# EAGLE schematic AZR3350 (EAGLE 9.3.0)
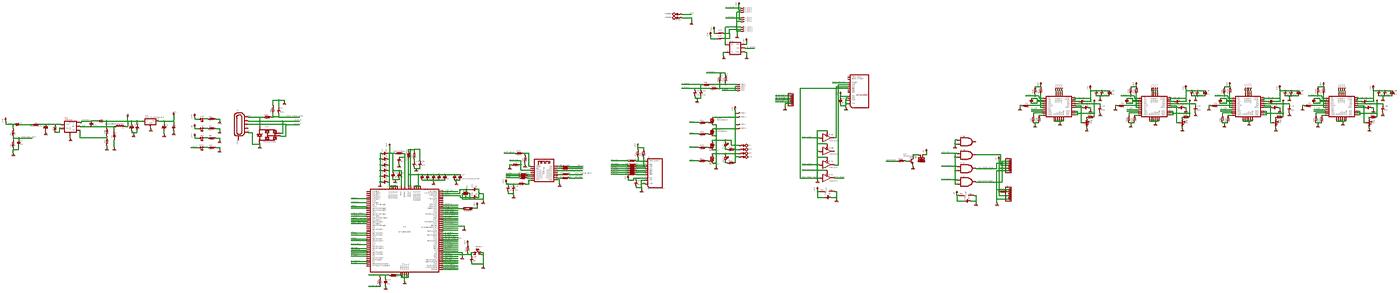
[diagram p0: schematic, sheet 1, overview]
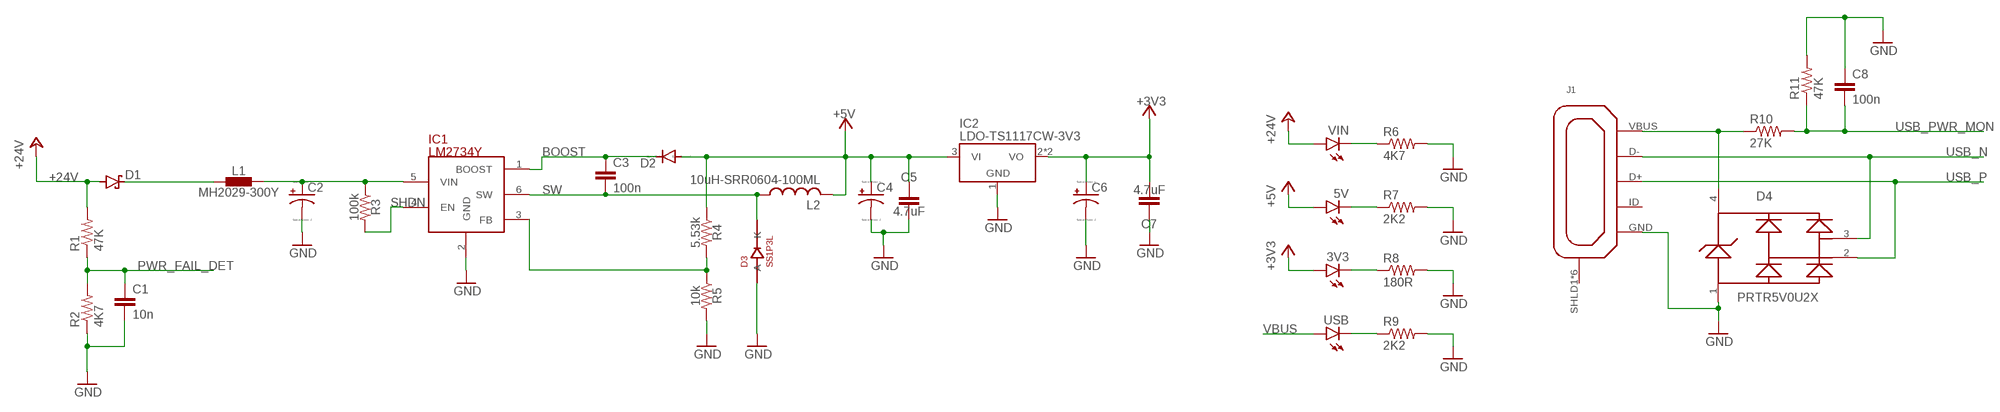
[diagram p1: schematic, sheet 1, part 1 of 5]
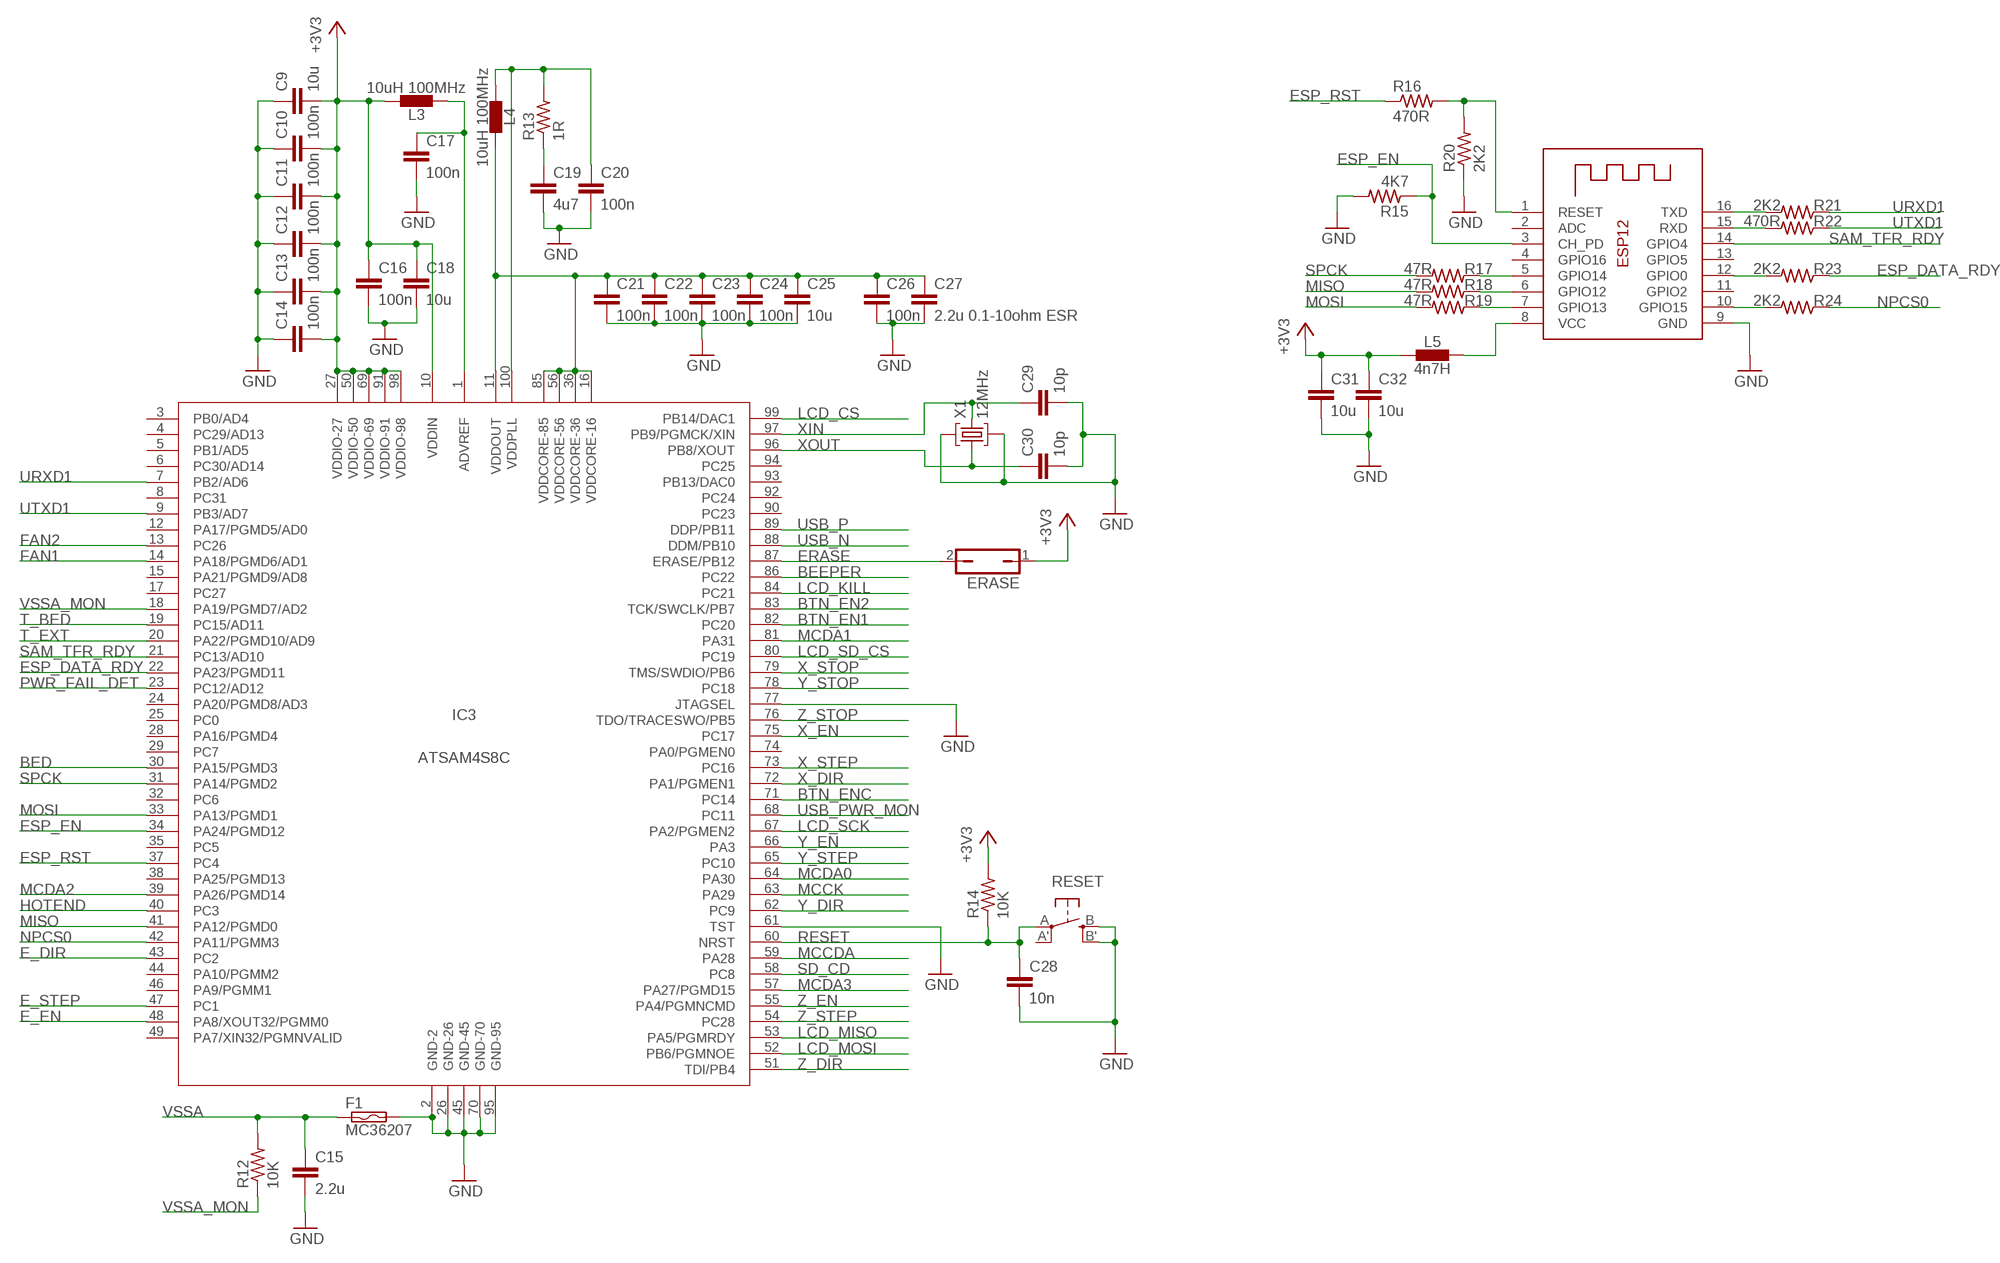
[diagram p2: schematic, sheet 1, part 2 of 5]
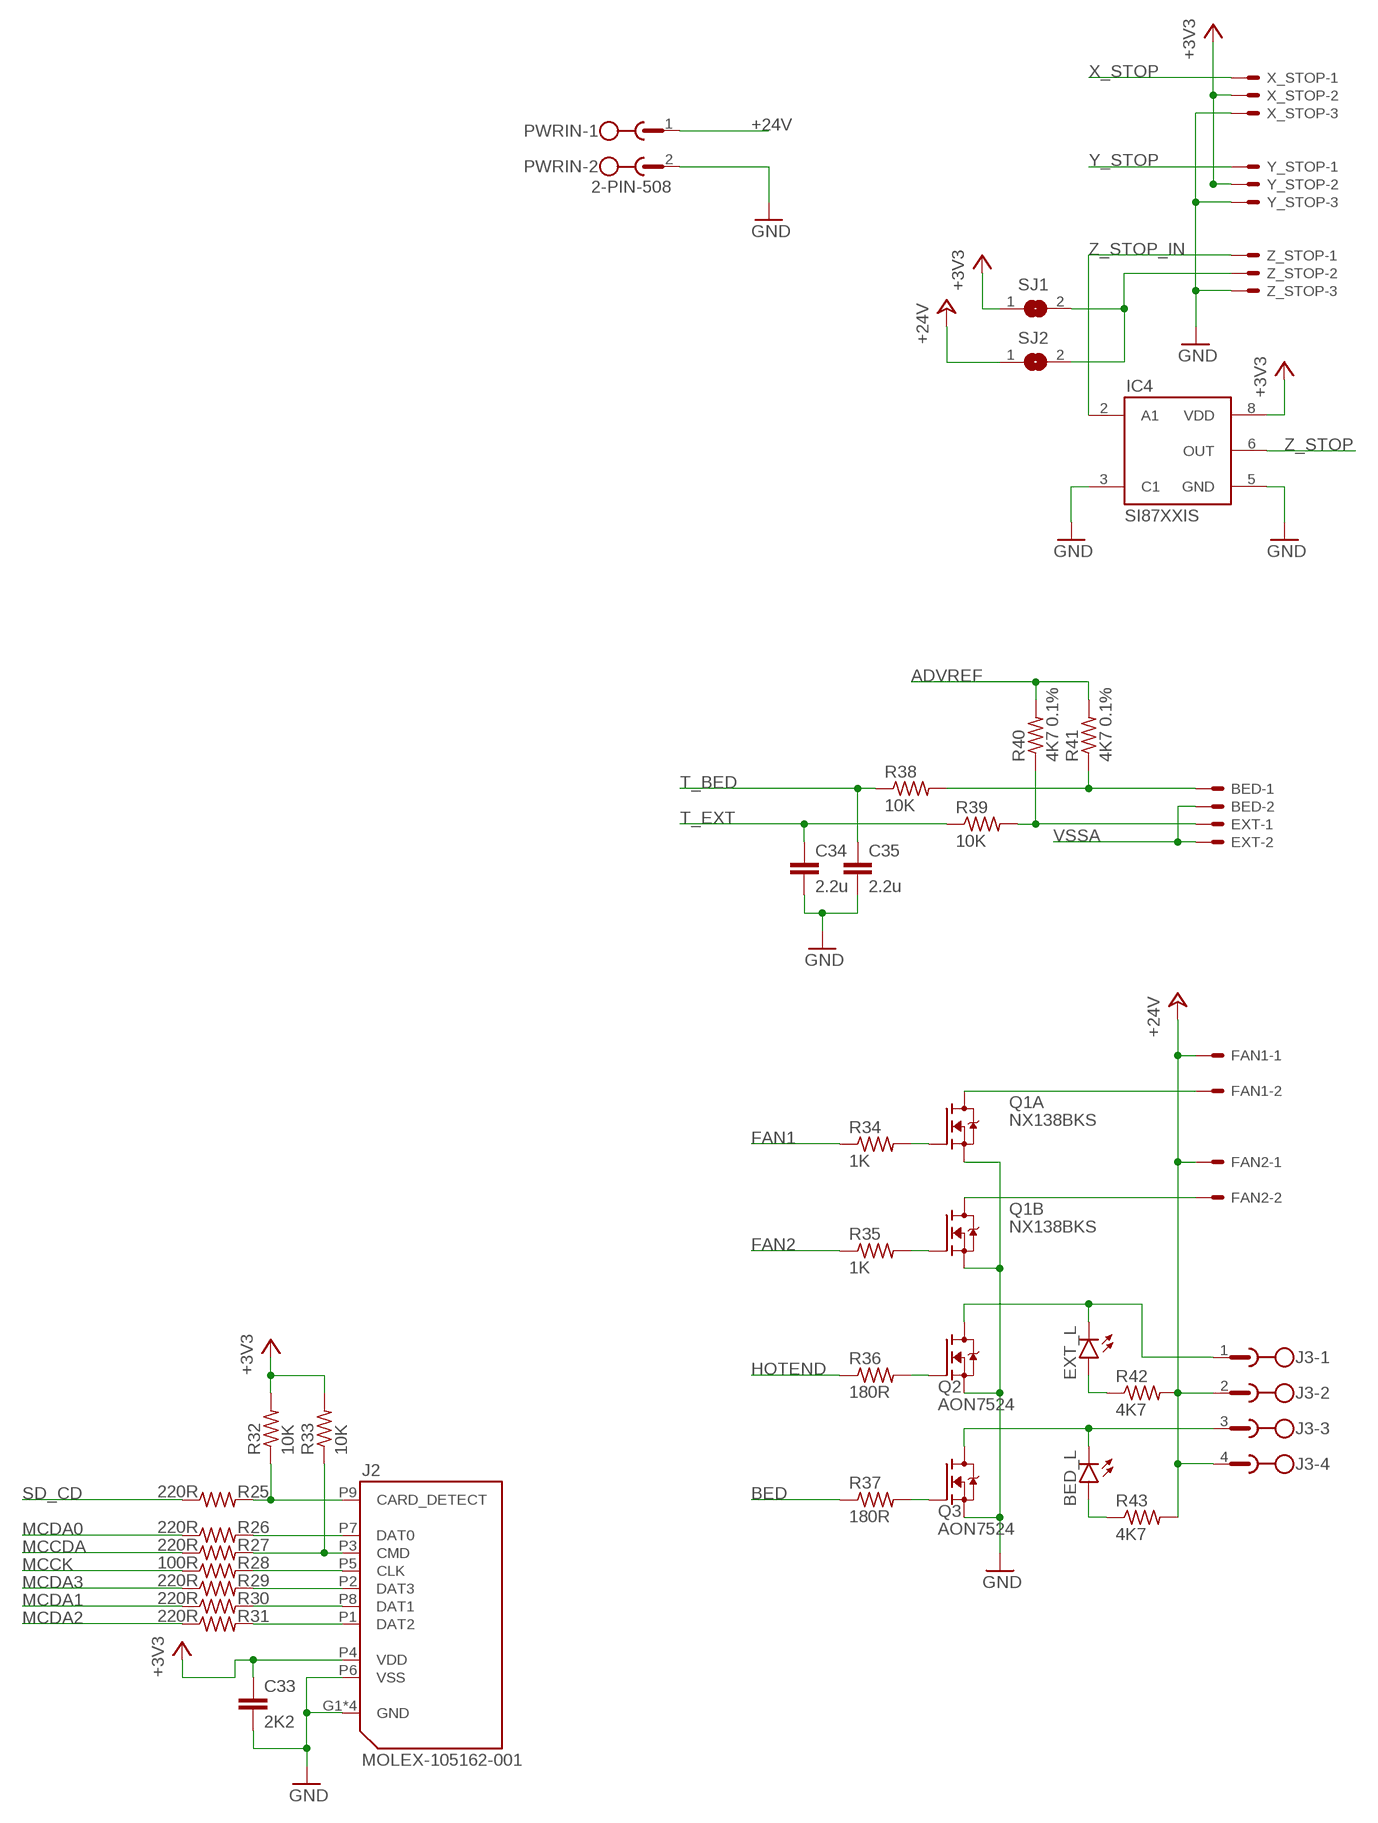
[diagram p3: schematic, sheet 1, part 3 of 5]
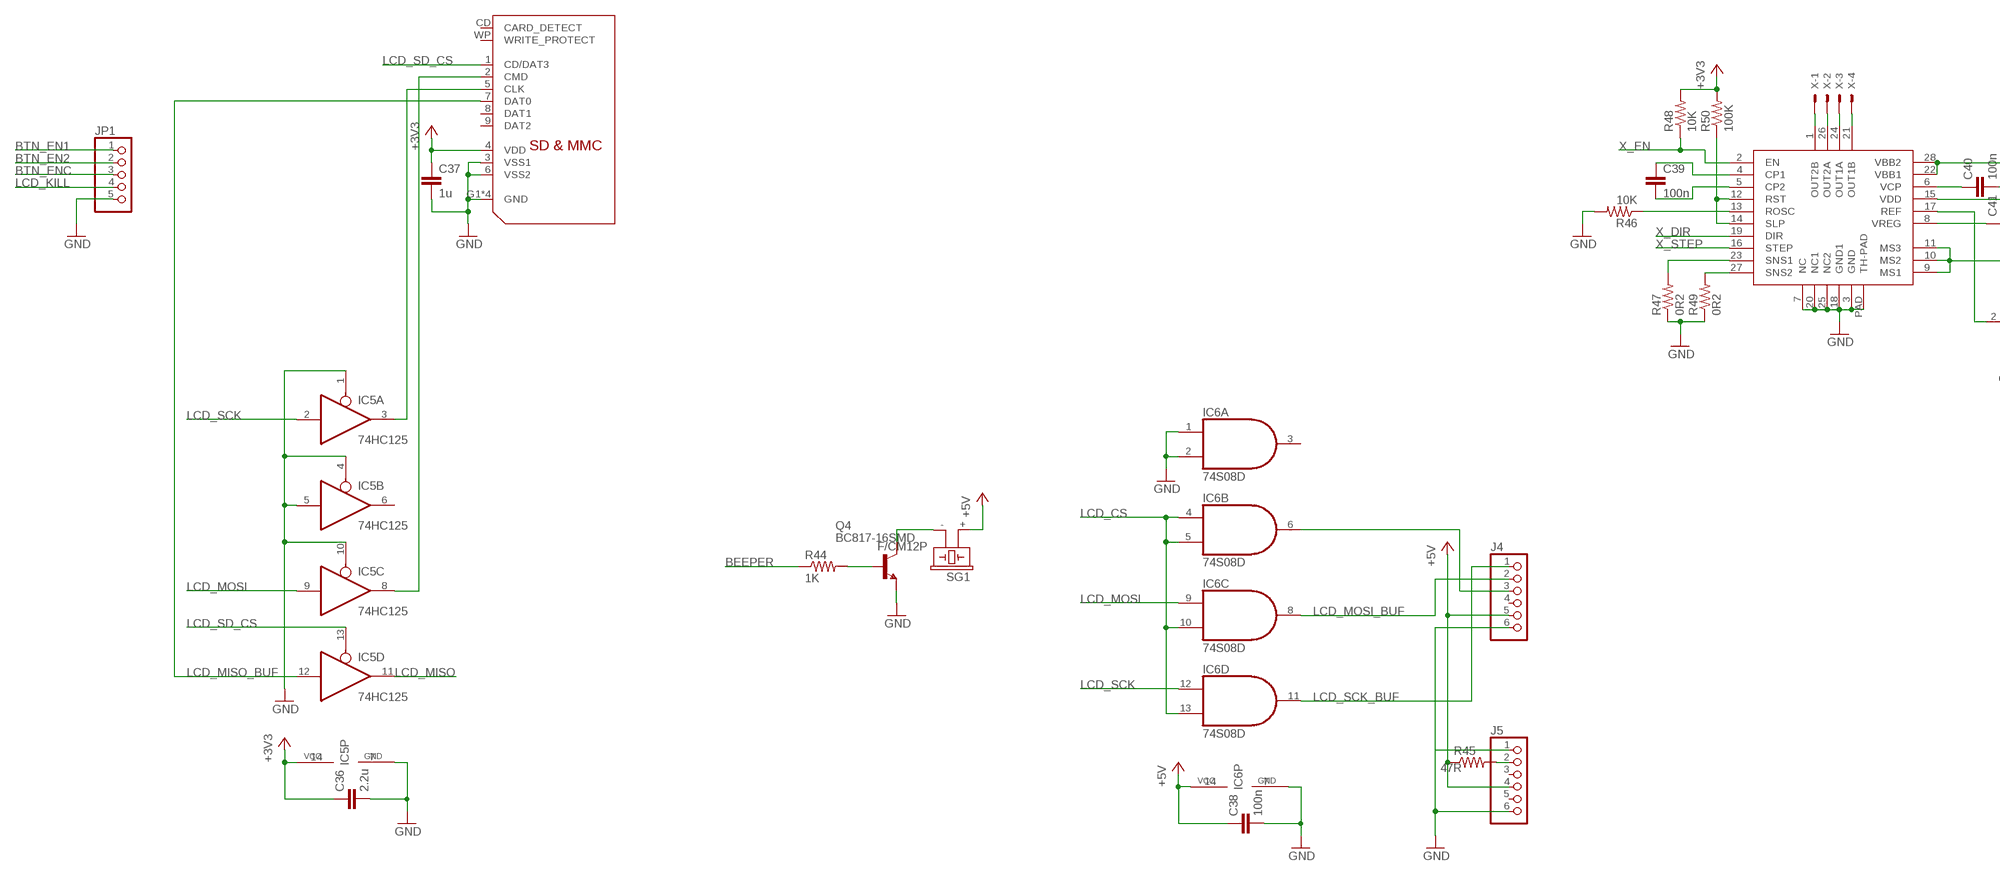
[diagram p4: schematic, sheet 1, part 4 of 5]
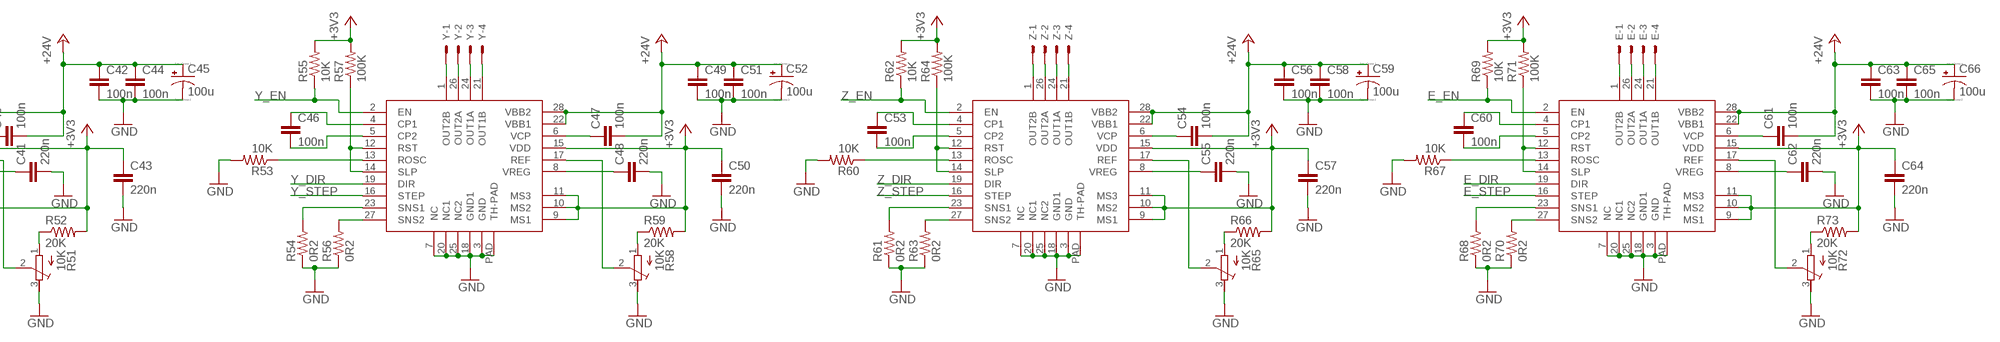
[diagram p5: schematic, sheet 1, part 5 of 5]

## Parts
3V3  LEDCHIPLED_0805  [CHIPLED_0805]
5V  LEDCHIPLED_0805  [CHIPLED_0805]
BED  KK-254-2  [MOLEX-KK-254-2]
BED_L  LEDCHIPLED_0805  [CHIPLED_0805]
C1  10n  C-EUC0603  [C0603]
C2  10uF  CPOL-USD  [PANASONIC_D]
C3  100n  C-EUC0603  [C0603]
C4  47u  CPOL-USD  [PANASONIC_D]
C5  4.7uF  C-EUC0603  [C0603]
C6  10uF  CPOL-USD  [PANASONIC_D]
C7  4.7uF  C-EUC0603  [C0603]
C8  100n  C-EUC0603  [C0603]
C9  10u  C-EUC0805  [C0805]
C10  100n  C-EUC0603  [C0603]
C11  100n  C-EUC0603  [C0603]
C12  100n  C-EUC0603  [C0603]
C13  100n  C-EUC0603  [C0603]
C14  100n  C-EUC0603  [C0603]
C15  2.2u  C-EUC0603  [C0603]
C16  100n  C-EUC0603  [C0603]
C17  100n  C-EUC0603  [C0603]
C18  10u  C-EUC0603  [C0603]
C19  4u7  C-EUC0603  [C0603]
C20  100n  C-EUC0603  [C0603]
C21  100n  C-EUC0603  [C0603]
C22  100n  C-EUC0603  [C0603]
C23  100n  C-EUC0603  [C0603]
C24  100n  C-EUC0603  [C0603]
C25  10u  C-EUC0805  [C0805]
C26  100n  C-EUC0603  [C0603]
C27  2.2u 0.1-10ohm ESR  C-EUC0603  [C0603]
C28  10n  C-EUC0603  [C0603]
C29  10p  C-EUC0603  [C0603]
C30  10p  C-EUC0603  [C0603]
C31  10u  C-EUC0603  [C0603]
C32  10u  C-EUC0603  [C0603]
C33  2K2  C-EUC0603  [C0603]
C34  2.2u  C-EUC0603  [C0603]
C35  2.2u  C-EUC0603  [C0603]
C36  2.2u  C-EUC0603  [C0603]
C37  1u  C-EUC0603  [C0603]
C38  100n  C-EUC0603  [C0603]
C39  100n  C-EUC0603  [C0603]
C40  100n  C-EUC0603  [C0603]
C41  220n  C-EUC0603  [C0603]
C42  100n  C-EUC0603  [C0603]
C43  220n  C-EUC0603  [C0603]
C44  100n  C-EUC0603  [C0603]
C45  100u  CPOL-USD  [PANASONIC_D]
C46  100n  C-EUC0603  [C0603]
C47  100n  C-EUC0603  [C0603]
C48  220n  C-EUC0603  [C0603]
C49  100n  C-EUC0603  [C0603]
C50  220n  C-EUC0603  [C0603]
C51  100n  C-EUC0603  [C0603]
C52  100u  CPOL-USD  [PANASONIC_D]
C53  100n  C-EUC0603  [C0603]
C54  100n  C-EUC0603  [C0603]
C55  220n  C-EUC0603  [C0603]
C56  100n  C-EUC0603  [C0603]
C57  220n  C-EUC0603  [C0603]
C58  100n  C-EUC0603  [C0603]
C59  100u  CPOL-USD  [PANASONIC_D]
C60  100n  C-EUC0603  [C0603]
C61  100n  C-EUC0603  [C0603]
C62  220n  C-EUC0603  [C0603]
C63  100n  C-EUC0603  [C0603]
C64  220n  C-EUC0603  [C0603]
C65  100n  C-EUC0603  [C0603]
C66  100u  CPOL-USD  [PANASONIC_D]
D1  BYS10-45-E3  SCHOTTKY-DIODESMD  [SMB]
D2  CD1206-S01575  DIODE-SOD123  [SOD123]
D3  SS1P3L  0025_SS1P3L-M3/84A  [DO220AAL]
D4  PRTR5V0U2XB  [SOT143B]
E  KK-254-4  [MOLEX-KK-254-4]
ERASE  JP1Q  [JP1]
ES1  ESP-12  [ESP-12]
EXT  KK-254-2  [MOLEX-KK-254-2]
EXT_L  LEDCHIPLED_0805  [CHIPLED_0805]
F1  MC36207  [MC36207]
FAN1  KK-254-2  [MOLEX-KK-254-2]
FAN2  KK-254-2  [MOLEX-KK-254-2]
IC1  LM2734Y  0179_LM2734YMK  [SOT23-6]
IC2  LDO-TS1117CW-3V3  [SOT223]
IC3  ATSAM4S8C  [LQFP100]
IC4  SI87XXIS  [SOIC08-FAIRCHILD]
IC5  74HC125  [SO14]
IC6  74S08D  [SO14]
IC7  A4988  [QFN28-TP]
IC8  A4988  [QFN28-TP]
IC9  A4988  [QFN28-TP]
IC10  A4988  [QFN28-TP]
J1  ZX62-AB-5PA  [USB-MICRO-10103594]
J2  MOLEX-105162-001  [MOLEX-105162]
J3  MSTBV4  [MSTBV4]
J4  PINHD-1X6  [1X06/90]
J5  PINHD-1X6  [1X06/90]
JP1  PINHD-1X5  [1X05]
L1  MH2029-300Y  INDUCTOR-0805  [C0805]
L2  10uH-SRR0604-100ML  0031_SRR0604-100ML  [SRR0604]
L3  10uH 100MHz  INDUCTOR-0603  [C0603]
L4  10uH 100MHz  INDUCTOR-0603  [C0603]
L5  4n7H  INDUCTOR-0603  [C0603]
PWRIN  2-PIN-508  [2-PIN-508]
Q1  NX138BKS  [SOT363_PHILIPS]
Q2  AON7524  [3X3DFN-EP]
Q3  AON7524  [3X3DFN-EP]
Q4  BC817-16SMD  [SOT23-BEC]
R1  47K  R-US_R0603  [R0603]
R2  4K7  R-US_R0603  [R0603]
R3  100k  R-US_R0603  [R0603]
R4  5.53k  R-US_R0603  [R0603]
R5  10k  R-US_R0603  [R0603]
R6  4K7  R-US_R0603  [R0603]
R7  2K2  R-US_R0603  [R0603]
R8  180R  R-US_R0603  [R0603]
R9  2K2  R-US_R0603  [R0603]
R10  27K  R-US_R0603  [R0603]
R11  47K  R-US_R0603  [R0603]
R12  10K  R-US_R0603  [R0603]
R13  1R  R-US_R0603  [R0603]
R14  10K  R-US_R0603  [R0603]
R15  4K7  R-US_R0603  [R0603]
R16  470R  R-US_R0603  [R0603]
R17  47R  R-US_R0603  [R0603]
R18  47R  R-US_R0603  [R0603]
R19  47R  R-US_R0603  [R0603]
R20  2K2  R-US_R0603  [R0603]
R21  2K2  R-US_R0603  [R0603]
R22  470R  R-US_R0603  [R0603]
R23  2K2  R-US_R0603  [R0603]
R24  2K2  R-US_R0603  [R0603]
R25  220R  R-US_R0603  [R0603]
R26  220R  R-US_R0603  [R0603]
R27  220R  R-US_R0603  [R0603]
R28  100R  R-US_R0603  [R0603]
R29  220R  R-US_R0603  [R0603]
R30  220R  R-US_R0603  [R0603]
R31  220R  R-US_R0603  [R0603]
R32  10K  R-US_R0603  [R0603]
R33  10K  R-US_R0603  [R0603]
R34  1K  R-US_R0603  [R0603]
R35  1K  R-US_R0603  [R0603]
R36  180R  R-US_R0603  [R0603]
R37  180R  R-US_R0603  [R0603]
R38  10K  R-US_R0603  [R0603]
R39  10K  R-US_R0603  [R0603]
R40  4K7 0.1%  R-US_R0603  [R0603]
R41  4K7 0.1%  R-US_R0603  [R0603]
R42  4K7  R-US_R0603  [R0603]
R43  4K7  R-US_R0603  [R0603]
R44  1K  R-US_R0603  [R0603]
R45  47R  R-US_R0603  [R0603]
R46  10K  R-US_R0603  [R0603]
R47  0R2  R-US_R0805  [R0805]
R48  10K  R-US_R0603  [R0603]
R49  0R2  R-US_R0805  [R0805]
R50  100K  R-US_R0603  [R0603]
R51  10K  R-TRIMM3103  [RTRIM3103]
R52  20K  R-US_R0603  [R0603]
R53  10K  R-US_R0603  [R0603]
R54  0R2  R-US_R0805  [R0805]
R55  10K  R-US_R0603  [R0603]
R56  0R2  R-US_R0805  [R0805]
R57  100K  R-US_R0603  [R0603]
R58  10K  R-TRIMM3103  [RTRIM3103]
R59  20K  R-US_R0603  [R0603]
R60  10K  R-US_R0603  [R0603]
R61  0R2  R-US_R0805  [R0805]
R62  10K  R-US_R0603  [R0603]
R63  0R2  R-US_R0805  [R0805]
R64  100K  R-US_R0603  [R0603]
R65  10K  R-TRIMM3103  [RTRIM3103]
R66  20K  R-US_R0603  [R0603]
R67  10K  R-US_R0603  [R0603]
R68  0R2  R-US_R0805  [R0805]
R69  10K  R-US_R0603  [R0603]
R70  0R2  R-US_R0805  [R0805]
R71  100K  R-US_R0603  [R0603]
R72  10K  R-TRIMM3103  [RTRIM3103]
R73  20K  R-US_R0603  [R0603]
RESET  EVQQ2  [EVQQ2]
SG1  F/CM12P  [F/CM12P]
SJ1  SJ  [SJ]
SJ2  SJ  [SJ]
USB  LEDCHIPLED_0805  [CHIPLED_0805]
VIN  LEDCHIPLED_0805  [CHIPLED_0805]
X  KK-254-4  [MOLEX-KK-254-4]
X1  12MHz  CRYSTAL-4PIN  [5.0X3.2_KX-9A]
X2  TE-2041021  [2041021]
X_STOP  KK-254-3  [MOLEX-KK-254-3]
Y  KK-254-4  [MOLEX-KK-254-4]
Y_STOP  KK-254-3  [MOLEX-KK-254-3]
Z  KK-254-4  [MOLEX-KK-254-4]
Z_STOP  KK-254-3  [MOLEX-KK-254-3]

## Nets
3V3_LED: 3V3.C R8.1
5V_LED: 5V.C R7.1
24V_LED: R6.1 VIN.C
+3V3: 3V3.A C6.+ C7.2 C9.2 C10.2 C11.2 C12.2 C13.2 C14.2 C16.1 C18.1 C31.1 C32.1 C33.1 C36.1 C37.1 C43.1 C50.1 C57.1 C64.1 ERASE.1 IC2.2(VO) IC2.4(VO) IC3.10(VDDIN) IC3.27(VDDIO-27) IC3.50(VDDIO-50) IC3.69(VDDIO-69) IC3.91(VDDIO-91) IC3.98(VDDIO-98) IC4.8(VDD) IC5.14(P:VCC) IC7.9(MS1) IC7.10(MS2) IC7.11(MS3) IC7.15(VDD) IC8.9(MS1) IC8.10(MS2) IC8.11(MS3) IC8.15(VDD) IC9.9(MS1) IC9.10(MS2) IC9.11(MS3) IC9.15(VDD) IC10.9(MS1) IC10.10(MS2) IC10.11(MS3) IC10.15(VDD) J2.P4(VDD) L3.2 L5.1 R14.2 R32.2 R33.2 R48.2 R50.2 R52.2 R55.2 R57.2 R59.2 R62.2 R64.2 R66.2 R69.2 R71.2 R73.2 SJ1.1 X2.4(VDD) X_STOP.2 Y_STOP.2
+5V [usbvcc]: 5V.A C4.+ C5.1 C38.1 D2.A IC2.3(VI) IC6.14(P:VCC) J4.5 J5.4 L2.P$2 R4.1 R45.1 SG1.+
+24V: C40.2 C42.1 C44.1 C45.+ C47.2 C49.1 C51.1 C52.+ C54.2 C56.1 C58.1 C59.+ C61.2 C63.1 C65.1 C66.+ D1.A FAN1.1 FAN2.1 IC7.22(VBB1) IC7.28(VBB2) IC8.22(VBB1) IC8.28(VBB2) IC9.22(VBB1) IC9.28(VBB2) IC10.22(VBB1) IC10.28(VBB2) J3.2 J3.4 PWRIN.1 R1.2 R42.2 R43.2 SJ2.1 VIN.A
ADVREF: C17.1 IC3.1(ADVREF) L3.1 R40.2 R41.2
BED: IC3.30(PA15/PGMD3) R37.1
BED_D: BED_L.C J3.3 Q3.5(D) Q3.6(D) Q3.7(D) Q3.8(D) Q3.E1(D) Q3.E2(D) Q3.PAD(D)
BED_G: Q3.4(G) R37.2
BED_L: BED_L.A R43.1
BEEPER: IC3.86(PC22) R44.1
BOOST: C3.1 D2.C IC1.1(BOOST)
BTN_EN1: IC3.82(PC20) JP1.1
BTN_EN2: IC3.83(TCK/SWCLK/PB7) JP1.2
BTN_ENC: IC3.71(PC14) JP1.3
CLK: J2.P5(CLK) R28.2
CMD: J2.P3(CMD) R27.2 R33.1
CP1E: C60.1 IC10.4(CP1)
CP1X: C39.1 IC7.4(CP1)
CP1Y: C46.1 IC8.4(CP1)
CP1Z: C53.1 IC9.4(CP1)
CP2E: C60.2 IC10.5(CP2)
CP2X: C39.2 IC7.5(CP2)
CP2Y: C46.2 IC8.5(CP2)
CP2Z: C53.2 IC9.5(CP2)
DAT0: J2.P7(DAT0) R26.2
DAT1: J2.P8(DAT1) R30.2
DAT2: J2.P1(DAT2) R31.2
DAT3: J2.P2(DAT3) R29.2
DET: J2.P9(CARD_DETECT) R25.2 R32.1
E_DIR: IC3.43(PC2) IC10.19(DIR)
E_EN: IC3.48(PA8/XOUT32/PGMM0) IC10.2(EN) R69.1
E_STEP: IC3.47(PC1) IC10.16(STEP)
EDR_CONN: ES1.12(GPIO0) R23.2
EMOT1A: E.3 IC10.24(OUT1A)
EMOT1B: E.4 IC10.21(OUT1B)
EMOT2A: E.2 IC10.26(OUT2A)
EMOT2B: E.1 IC10.1(OUT2B)
ERASE: ERASE.2 IC3.87(ERASE/PB12)
ESP_CS: ES1.10(GPIO15) R24.2
ESP_DATA_RDY: IC3.22(PA23/PGMD11) R23.1
ESP_EN: ES1.3(CH_PD) IC3.34(PA24/PGMD12) R15.1
ESP_MISO: ES1.6(GPIO12) R18.1
ESP_MOSI: ES1.7(GPIO13) R19.1
ESP_RESET: ES1.1(RESET) R16.2 R20.2
ESP_RST: IC3.37(PC4) R16.1
ESP_SPCK: ES1.5(GPIO14) R17.1
ESP_URDX: ES1.16(TXD) R21.2
ESP_UTDX: ES1.15(RXD) R22.2
ESP_VIN: ES1.8(VCC) L5.2
EXT_D: EXT_L.C J3.1 Q2.5(D) Q2.6(D) Q2.7(D) Q2.8(D) Q2.E1(D) Q2.E2(D) Q2.PAD(D)
EXT_G: Q2.4(G) R36.2
EXT_L: EXT_L.A R42.1
FAN1: IC3.14(PA18/PGMD6/AD1) R34.1
FAN1_D: FAN1.2 Q1.6(A:D)
FAN1_G: Q1.2(A:G) R34.2
FAN2: IC3.13(PC26) R35.1
FAN2_D: FAN2.2 Q1.3(B:D)
FAN2_G: Q1.5(B:G) R35.2
FB: IC1.3(FB) R4.2 R5.1
GND: C1.2 C2.- C4.- C5.2 C6.- C7.1 C8.1 C9.1 C10.1 C11.1 C12.1 C13.1 C14.1 C15.2 C16.2 C17.2 C18.2 C19.2 C20.2 C21.2 C22.2 C23.2 C24.2 C25.2 C26.2 C27.2 C28.2 C29.2 C30.2 C31.2 C32.2 C33.2 C34.2 C35.2 C36.2 C37.2 C38.2 C41.2 C42.2 C43.2 C44.2 C45.- C48.2 C49.2 C50.2 C51.2 C52.- C55.2 C56.2 C57.2 C58.2 C59.- C62.2 C63.2 C64.2 C65.2 C66.- D3.P$2(A) D4.1 ES1.9(GND) F1.2 IC1.2(GND) IC2.1(GND) IC3.2(GND-2) IC3.26(GND-26) IC3.45(GND-45) IC3.61(TST) IC3.70(GND-70) IC3.77(JTAGSEL) IC3.95(GND-95) IC4.3(C1) IC4.5(GND) IC5.1(A:OE) IC5.4(B:OE) IC5.5(B:I) IC5.7(P:GND) IC5.10(C:OE) IC6.1(A:I0) IC6.2(A:I1) IC6.7(P:GND) IC7.3(GND) IC7.7(NC) IC7.18(GND1) IC7.20(NC1) IC7.25(NC2) IC7.PAD(TH-PAD) IC8.3(GND) IC8.7(NC) IC8.18(GND1) IC8.20(NC1) IC8.25(NC2) IC8.PAD(TH-PAD) IC9.3(GND) IC9.7(NC) IC9.18(GND1) IC9.20(NC1) IC9.25(NC2) IC9.PAD(TH-PAD) IC10.3(GND) IC10.7(NC) IC10.18(GND1) IC10.20(NC1) IC10.25(NC2) IC10.PAD(TH-PAD) J1.GND J2.G1(GND) J2.G2(GND) J2.G3(GND) J2.G4(GND) J2.P6(VSS) J4.6 J5.1 J5.6 JP1.5 PWRIN.2 Q1.1(A:S) Q1.4(B:S) Q2.1(S) Q2.2(S) Q2.3(S) Q3.1(S) Q3.2(S) Q3.3(S) Q4.E R2.1 R5.2 R6.2 R7.2 R8.2 R9.2 R11.2 R15.2 R20.1 R46.2 R47.1 R49.1 R51.3(E) R53.2 R54.1 R56.1 R58.3(E) R60.2 R61.1 R63.1 R65.3(E) R67.2 R68.1 R70.1 R72.3(E) RESET.B'(S1) RESET.B(S) X1.2 X1.4 X2.3(VSS1) X2.6(VSS2) X2.G1(GND) X2.G2(GND) X2.G3(GND) X2.G4(GND) X_STOP.3 Y_STOP.3 Z_STOP.3
HOTEND: IC3.40(PC3) R36.1
LCD_CS: IC3.99(PB14/DAC1) IC6.4(B:I0) IC6.5(B:I1) IC6.10(C:I1) IC6.13(D:I1)
LCD_CS_BUF: IC6.6(B:O) J4.3
LCD_KILL: IC3.84(PC21) JP1.4
LCD_MISO: IC3.53(PA5/PGMRDY) IC5.11(D:O)
LCD_MISO_BUF: IC5.12(D:I) X2.7(DAT0)
LCD_MOSI: IC3.52(PB6/PGMNOE) IC5.9(C:I) IC6.9(C:I0)
LCD_MOSI_BUF: IC6.8(C:O) J4.2
LCD_SCK: IC3.67(PA2/PGMEN2) IC5.2(A:I) IC6.12(D:I0)
LCD_SCK_BUF: IC6.11(D:O) J4.1
LCD_SD_CS: IC3.80(PC19) IC5.13(D:OE) X2.1(CD/DAT3)
MCCDA: IC3.59(PA28) R27.1
MCCK: IC3.63(PA29) R28.1
MCDA0: IC3.64(PA30) R26.1
MCDA1: IC3.81(PA31) R30.1
MCDA2: IC3.39(PA26/PGMD14) R31.1
MCDA3: IC3.57(PA27/PGMD15) R29.1
MISO: IC3.41(PA12/PGMD0) R18.2
MOSI: IC3.33(PA13/PGMD1) R19.2
N$1: C19.1 R13.1
N$2: J5.2 R45.2
N$3: C2.+ IC1.5(VIN) L1.2 R3.1
N$7: Q4.B R44.2
N$8: Q4.C SG1.-
NPCS0: IC3.42(PA11/PGMM3) R24.1
PWR_FAIL_DET: C1.1 IC3.23(PC12/AD12) R1.1 R2.2
REFE: IC10.17(REF) R72.2(S)
REFE-IN: R72.1(A) R73.1
REFX: IC7.17(REF) R51.2(S)
REFX-IN: R51.1(A) R52.1
REFY: IC8.17(REF) R58.2(S)
REFY-IN: R58.1(A) R59.1
REFZ: IC9.17(REF) R65.2(S)
REFZ-IN: R65.1(A) R66.1
RESET: C28.1 IC3.60(NRST) R14.1 RESET.A(P)
ROSCE: IC10.13(ROSC) R67.1
ROSCX: IC7.13(ROSC) R46.1
ROSCY: IC8.13(ROSC) R53.1
ROSCZ: IC9.13(ROSC) R60.1
RSTE: IC10.12(RST) IC10.14(SLP) R71.1
RSTX: IC7.12(RST) IC7.14(SLP) R50.1
RSTY: IC8.12(RST) IC8.14(SLP) R57.1
RSTZ: IC9.12(RST) IC9.14(SLP) R64.1
SAM_TFR_RDY: ES1.14(GPIO4) IC3.21(PC13/AD10)
SD_CD: IC3.58(PC8) R25.1
SD_MOSI_BUF: IC5.8(C:O) X2.2(CMD)
SD_SCK_BUF: IC5.3(A:O) X2.5(CLK)
SHDN: IC1.4(EN) R3.2
SNS1E: IC10.23(SNS1) R68.2
SNS1X: IC7.23(SNS1) R47.2
SNS1Y: IC8.23(SNS1) R54.2
SNS1Z: IC9.23(SNS1) R61.2
SNS2E: IC10.27(SNS2) R70.2
SNS2X: IC7.27(SNS2) R49.2
SNS2Y: IC8.27(SNS2) R56.2
SNS2Z: IC9.27(SNS2) R63.2
SPCK: IC3.31(PA14/PGMD2) R17.2
SW [USB]: C3.2 D3.P$1(K) IC1.6(SW) L2.P$1
T_BED: C35.1 IC3.19(PC15/AD11) R38.1
T_BED_IN: BED.1 R38.2 R41.1
T_EXT: C34.1 IC3.20(PA22/PGMD10/AD9) R39.1
T_EXT_IN: EXT.1 R39.2 R40.1
URXD1: IC3.7(PB2/AD6) R21.1
USB_LED: R9.1 USB.C
USB_N [diff]: D4.3 IC3.88(DDM/PB10) J1.D-
USB_P [diff]: D4.2 IC3.89(DDP/PB11) J1.D+
USB_PWR_MON: C8.2 IC3.68(PC11) R10.2 R11.1
UTXD1: IC3.9(PB3/AD7) R22.1
VBUS: D4.4 J1.VBUS(VUSB) R10.1 USB.A
VCPE: C61.1 IC10.6(VCP)
VCPX: C40.1 IC7.6(VCP)
VCPY: C47.1 IC8.6(VCP)
VCPZ: C54.1 IC9.6(VCP)
VDDOUT: C21.1 C22.1 C23.1 C24.1 C25.1 C26.1 C27.1 IC3.11(VDDOUT) IC3.16(VDDCORE-16) IC3.36(VDDCORE-36) IC3.56(VDDCORE-56) IC3.85(VDDCORE-85) L4.2
VDDPLL: C20.1 IC3.100(VDDPLL) L4.1 R13.2
VIN_F: D1.C L1.1
VREGE: C62.1 IC10.8(VREG)
VREGX: C41.1 IC7.8(VREG)
VREGY: C48.1 IC8.8(VREG)
VREGZ: C55.1 IC9.8(VREG)
VSSA: BED.2 C15.1 EXT.2 F1.1 R12.2
VSSA_MON: IC3.18(PA19/PGMD7/AD2) R12.1
X_DIR: IC3.72(PA1/PGMEN1) IC7.19(DIR)
X_EN: IC3.75(PC17) IC7.2(EN) R48.1
X_STEP: IC3.73(PC16) IC7.16(STEP)
X_STOP: IC3.79(TMS/SWDIO/PB6) X_STOP.1
XIN: C29.1 IC3.97(PB9/PGMCK/XIN) X1.3
XMOT1A: IC7.24(OUT1A) X.3
XMOT1B: IC7.21(OUT1B) X.4
XMOT2A: IC7.26(OUT2A) X.2
XMOT2B: IC7.1(OUT2B) X.1
XOUT: C30.1 IC3.96(PB8/XOUT) X1.1
Y_DIR: IC3.62(PC9) IC8.19(DIR)
Y_EN: IC3.66(PA3) IC8.2(EN) R55.1
Y_STEP: IC3.65(PC10) IC8.16(STEP)
Y_STOP: IC3.78(PC18) Y_STOP.1
YMOT1A: IC8.24(OUT1A) Y.3
YMOT1B: IC8.21(OUT1B) Y.4
YMOT2A: IC8.26(OUT2A) Y.2
YMOT2B: IC8.1(OUT2B) Y.1
Z_DIR: IC3.51(TDI/PB4) IC9.19(DIR)
Z_EN: IC3.55(PA4/PGMNCMD) IC9.2(EN) R62.1
Z_STEP: IC3.54(PC28) IC9.16(STEP)
Z_STOP: IC3.76(TDO/TRACESWO/PB5) IC4.6(OUT)
Z_STOP_IN: IC4.2(A1) Z_STOP.1
ZMOT1A: IC9.24(OUT1A) Z.3
ZMOT1B: IC9.21(OUT1B) Z.4
ZMOT2A: IC9.26(OUT2A) Z.2
ZMOT2B: IC9.1(OUT2B) Z.1
ZVSEL: SJ1.2 SJ2.2 Z_STOP.2
Unconnected: ES1.2(ADC) ES1.4(GPIO16) ES1.11(GPIO2) ES1.13(GPIO5) IC3.3(PB0/AD4) IC3.4(PC29/AD13) IC3.5(PB1/AD5) IC3.6(PC30/AD14) IC3.8(PC31) IC3.12(PA17/PGMD5/AD0) IC3.15(PA21/PGMD9/AD8) IC3.17(PC27) IC3.24(PA20/PGMD8/AD3) IC3.25(PC0) IC3.28(PA16/PGMD4) IC3.29(PC7) IC3.32(PC6) IC3.35(PC5) IC3.38(PA25/PGMD13) IC3.44(PA10/PGMM2) IC3.46(PA9/PGMM1) IC3.49(PA7/XIN32/PGMNVALID) IC3.74(PA0/PGMEN0) IC3.90(PC23) IC3.92(PC24) IC3.93(PB13/DAC0) IC3.94(PC25) IC5.6(B:O) IC6.3(A:O) J1.ID J1.SHLD1(SH) J1.SHLD2(SH) J1.SHLD3(SH) J1.SHLD4(SH) J1.SHLD5(SH) J1.SHLD6(SH) J4.4 J5.3 J5.5 RESET.A'(P1) X2.8(DAT1) X2.9(DAT2) X2.CD(CARD_DETECT) X2.WP(WRITE_PROTECT)

## Library data of the parts
3V3 5V BED_L EXT_L USB VIN = led:LED: LED OSRAM: - CHIPLED LG R971, LG N971, LY N971, LG Q971, LY Q971, LO R971, LY R971 LH N974, LH R974 LS Q976, LO Q976, LY Q976 LO Q996 - Hyper CHIPLED LW Q18S LB Q993, LB Q99A, LB R99A - SideLED LS A670, LO A670, LY A670, LG A670, LP A670 LB A673, LV A673, LT A673, LW A673 LH A674 LY A675 LS A676, LA A676, LO A676, LY A676, LW A676 LS A679, LY A679, LG A679 - Hyper Micro SIDELED® LS Y876, LA Y876, LO Y876, LY Y876 LT Y87S - SmartLED LW L88C, LW L88S LB L89C, LB L89S, LG L890 LS L89K, LO L89K, LY L89K LS L896, LA L896, LO L896, LY L896 - TOPLED LS T670, LO T670, LY T670, LG T670, LP T670 LSG T670, LSP T670, LSY T670, LOP T670, LYG T670 LG T671, LOG T671, LSG T671 LB T673, LV T673, LT T673, LW T673 LH T674 LS T676, LA T676, LO T676, LY T676, LB T676, LH T676, LSB T676, LW T676 LB T67C, LV T67C, LT T67C, LS T67K, LO T67K, LY T67K, LW E67C LS E67B, LA E67B, LO E67B, LY E67B, LB E67C, LV E67C, LT E67C LW T67C LS T679, LY T679, LG T679 LS T770, LO T770, LY T770, LG T770, LP T770 LB T773, LV T773, LT T773, LW T773 LH T774 LS E675, LA E675, LY E675, LS T675 LS T776, LA T776, LO T776, LY T776, LB T776 LHGB T686 LT T68C, LB T68C - Hyper Mini TOPLED® LB M676 - Mini TOPLED Santana® LG M470 LS M47K, LO M47K, LY M47K Source: http://www.osram.convergy.de LUXEON: - LUMILED® LXK2-PW12-R00, LXK2-PW12-S00, LXK2-PW14-U00, LXK2-PW14-V00 LXK2-PM12-R00, LXK2-PM12-S00, LXK2-PM14-U00 LXK2-PE12-Q00, LXK2-PE12-R00, LXK2-PE12-S00, LXK2-PE14-T00, LXK2-PE14-U00 LXK2-PB12-K00, LXK2-PB12-L00, LXK2-PB12-M00, LXK2-PB14-N00, LXK2-PB14-P00, LXK2-PB14-Q00 LXK2-PR12-L00, LXK2-PR12-M00, LXK2-PR14-Q00, LXK2-PR14-R00 LXK2-PD12-Q00, LXK2-PD12-R00, LXK2-PD12-S00 LXK2-PH12-R00, LXK2-PH12-S00 LXK2-PL12-P00, LXK2-PL12-Q00, LXK2-PL12-R00 Source: www.luxeon.com KINGBRIGHT: KA-3528ASYC Source: www.kingbright.com
BED EXT FAN1 FAN2 = con-other:KK-254-2
C1 C3 C5 C7-C44 C46-C51 C53-C58 C60-C65 = resistor:C-EU: CAPACITOR, European symbol
C2 C4 C6 C45 C52 C59 C66 = resistor:CPOL-US: POLARIZED CAPACITOR, American symbol
D1 = diode:SCHOTTKY-DIODE: Schottky Diode
D2 = diode:DIODE-: DIODE
D3 = Diodi:0025_SS1P3L-M3/84A: 1A 30V Schottky Barrier Rectifiers -SS1P3L-M3/84A; CASE: SMP; MONTHLY_USAGE: _____; PART_NUMBER: SS1P3L-M3/84A; PRICE: _____; SUPPLIER: _____; TYPE: Diodi
D4 = Arduino:PRTR5V0U2X
E X Y Z = con-other:KK-254-4
ERASE = jumper:JP1Q: JUMPER
ES1 = adafruit:ESP-12
F1 = misc:MC36207
IC1 = Circuito Integrato:0179_LM2734YMK: 1A Load Step-Down DC-DC Regulator - LM2734Y Switching; CASE: SOT23-5; MONTHLY_USAGE: _____; PART_NUMBER: LM2734YMK; PRICE: _____; SUPPLIER: _____; TYPE: Circuito_Integrato; VALUE: LM2734YMK
IC2 = we-power:LDO: LDOs TS1117 800mA max 15V - compatible NCP1117 1A max 20V TS9011 250mA max 12V - compatible AP2210 300mA max 15V TS5204 150mA max 16V
IC3 = misc:ATSAM4S8C
IC4 = misc:SI87XX
IC5 = misc:74HC125
IC6 = 74xx-us:74*08: Quad 2-input AND gate
IC7-IC10 = RepRapjr:A4988
J1 = Arduino:ZX62-AB-5PA
J2 = misc:MOLEX-105162-001
J3 = con-phoenix-508:MSTBV4: PHOENIX; MPN: MSTBV 2,5/4-GF-5.08; OC_FARNELL: 1792794; OC_NEWARK: 69R9847
J4 J5 = con-other:PINHD-1X6
JP1 = pinhead:PINHD-1X5: PIN HEADER
L1 = Arduino:INDUCTOR: Inductors
L2 = Induttanze:0031_SRR0604-100ML: SRR0604-100ML; CASE: SMD_6,5x6,5; MONTHLY_USAGE: _____; PART_NUMBER: SRR0604-100ML; PRICE: _____; SUPPLIER: _____; TYPE: Induttanze
L3-L5 = Zero_V1.0:INDUCTOR: Inductors
PWRIN = con-other:2-PIN-508
Q1 = misc:NX138BKS
Q2 Q3 = misc:AON7524
Q4 = transistor-npn:BC817*: NPN Transistor
R1-R50 R52-R57 R59-R64 R66-R71 R73 = resistor:R-US_: RESISTOR, American symbol
R51 R58 R65 R72 = resistor:R-TRIMM: Trimm resistor
RESET = misc:EVQQ2
SG1 = buzzer:F/CM12P: BUZZER Source: Buerklin; OC_FARNELL: unknown; OC_NEWARK: unknown
SJ1 SJ2 = jumper:SJ: SMD solder JUMPER
X1 = misc:CRYSTAL-4PIN
X2 = misc:TE-2041021
X_STOP Y_STOP Z_STOP = con-other:KK-254-3

## Net classes
1 USB: width 0.102 mm, drill 0.1 mm
2 gnd: width 0.102 mm, drill 0.1 mm
3 usbvcc: width 0.102 mm, drill 0.1 mm, clearance 0.15 mm
4 diff: width 0.203 mm